# Altium schematic sheet Ada - Sensor - issue 4.0.SchDoc
size A3; Organization: Panik Technology; Address1: Verona House; Address2: Filwood Road; Address3: Bristol BS16 3RY; Address4: Tel: 0117 965 7744; DocumentNumber: 2; Revision: 1.3; SheetNumber: 2; SheetTotal: 3; VersionControl_RevNumber: 1.3; ProjectName: TRI002
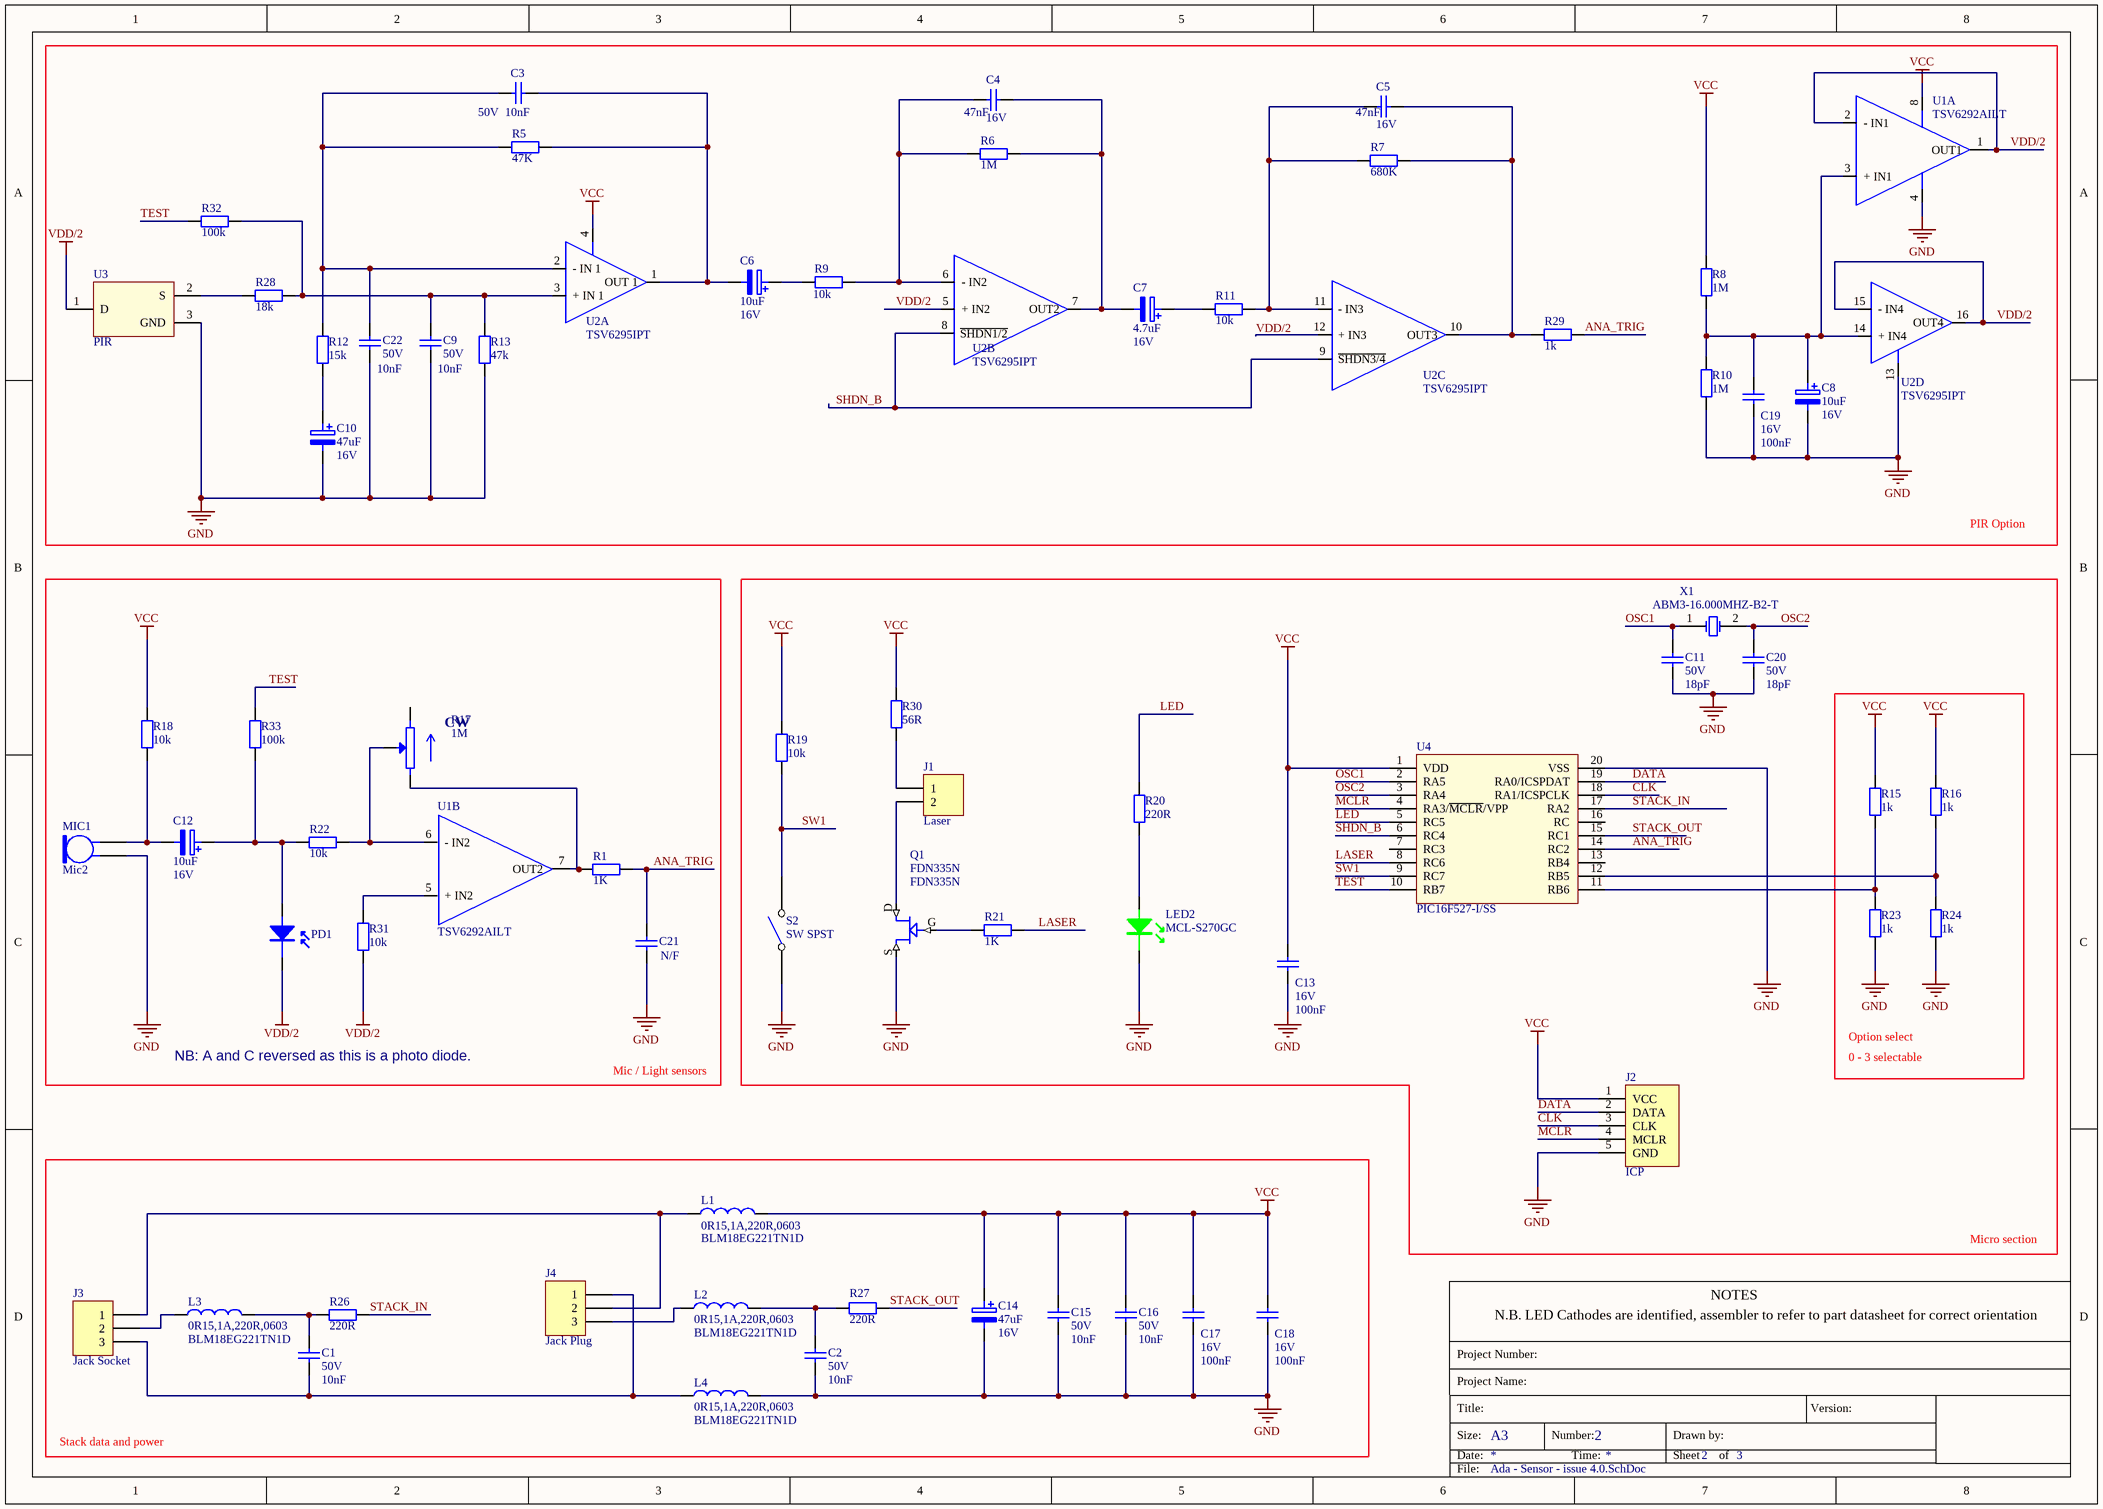
[diagram p0: Ada - Sensor - issue 4.0.SchDoc]

## Parts
C1  Voltage: 50V  [C0603]  (hidden comment: 10nF)
C2  Voltage: 50V  [C0603]  (hidden comment: 10nF)
C3  value 10nF  Voltage: 50V  [C0603]  (hidden comment: Capacitor 0805)
C4  value 47nF  Voltage: 16V  [C0603]  (hidden comment: Capacitor 0603)
C5  value 47nF  Voltage: 16V  [C0603]  (hidden comment: Capacitor 0603)
C6  value 10uF  Voltage: 16V  [CASE_A]  (hidden comment: 10uF, 16V, case A)
C7  value 4.7uF  Voltage: 16V  [CASE_A]  (hidden comment: 4.7uF, 16V, case A)
C8  value 10uF  Voltage: 16V  [CASE_A]  (hidden comment: 10uF, 16V, case A)
C9  value 10nF  Voltage: 50V  [C0603]  (hidden comment: Capacitor 0805)
C10  value 47uF  Voltage: 16V  [CAP6.8/6.8]  (hidden comment: 47uF, 16V, case D8)
C11  Voltage: 50V  [C0603]  (hidden comment: 18pF)
C12  value 10uF  Voltage: 16V  [CASE_A]  (hidden comment: 10uF, 16V, case A)
C13  value 100nF  Voltage: 16V  [C0603]  (hidden comment: 100nF, 16V, 0603)
C14  value 47uF  Voltage: 16V  [CAP6.8/6.8]  (hidden comment: 47uF, 16V, case D8)
C15  Voltage: 50V  [C0603]  (hidden comment: 10nF)
C16  Voltage: 50V  [C0603]  (hidden comment: 10nF)
C17  value 100nF  Voltage: 16V  [C0603]  (hidden comment: 100nF, 16V, 0603)
C18  value 100nF  Voltage: 16V  [C0603]  (hidden comment: 100nF, 16V, 0603)
C19  value 100nF  Voltage: 16V  [C0603]  (hidden comment: 100nF, 16V, 0603)
C20  Voltage: 50V  [C0603]  (hidden comment: 18pF)
C21  value N/F  [C0603]  (hidden comment: Capacitor 0603)
C22  value 10nF  Voltage: 50V  [C0603]  (hidden comment: Capacitor 0805)
J1  Laser  [SIP2]
J2  ICP  [ICP]
J3  Jack Socket  [sip3]
J4  Jack Plug  [3 way sip RA]
L1  0R15,1A,220R,0603  value BLM18EG221TN1D  [L0603]
L2  0R15,1A,220R,0603  value BLM18EG221TN1D  [L0603]
L3  0R15,1A,220R,0603  value BLM18EG221TN1D  [L0603]
L4  0R15,1A,220R,0603  value BLM18EG221TN1D  [L0603]
LED2  value MCL-S270GC  [LED, GREEN, 0805]  (hidden comment: LED GREEN 0805)
MIC1  Mic2  [ECM]
PD1  PHOTODIODE  [DOME LENS]  (value not drawn)
Q1  FDN335N  [SOT-23]
R1  value 1K  [R0603]  (hidden comment: Resistor 0603)
R5  value 47K  [R0603]  (hidden comment: Resistor 0603)
R6  value 1M  [R0603]  (hidden comment: Resistor 0603)
R7  value 680K  [R0603]  (hidden comment: Resistor 0603)
R8  value 1M  [R0603]  (hidden comment: Resistor 0603)
R9  value 10k  [R0603]  (hidden comment: Resistor 0603)
R10  value 1M  [R0603]  (hidden comment: Resistor 0603)
R11  value 10k  [R0603]  (hidden comment: Resistor 0603)
R12  value 15k  [R0603]  (hidden comment: Resistor 0603)
R13  value 47k  [R0603]  (hidden comment: Resistor 0805)
R15  value 1k  [R0603]  (hidden comment: Resistor 0603)
R16  value 1k  [R0603]  (hidden comment: Resistor 0603)
R17  1M  [preset_Iskra square]
R18  value 10k  [R0603]  (hidden comment: Resistor 0603)
R19  value 10k  [R0603]  (hidden comment: Resistor 0603)
R20  value 220R  [R0603]  (hidden comment: Resistor 0603)
R21  value 1K  [R0603]  (hidden comment: Resistor 0603)
R22  value 10k  [R0603]  (hidden comment: Resistor 0603)
R23  value 1k  [R0603]  (hidden comment: Resistor 0603)
R24  value 1k  [R0603]  (hidden comment: Resistor 0603)
R26  value 220R  [R0603]  (hidden comment: Resistor 0603)
R27  value 220R  [R0603]  (hidden comment: Resistor 0603)
R28  value 18k  [R0603]  (hidden comment: Resistor 0603)
R29  value 1k  [R0603]  (hidden comment: Resistor 0603)
R30  value 56R  [R0603]  (hidden comment: Resistor 0603)
R31  value 10k  [R0603]  (hidden comment: Resistor 0603)
R32  value 100k  [R0603]  (hidden comment: Resistor 0603)
R33  value 100k  [R0603]  (hidden comment: Resistor 0603)
S2  SW SPST  [MFP113D]
U1  TSV6292AILT  [SOT23 8 pin]  (parts A,B of 2)
U2  TSV6295IPT  [TSSOP16]  (parts A,B,C,D of 4)
U3  value PIR  [PIR_TO-5]  (hidden comment: LHI_968)
U4  PIC16F527-I/SS  [SSOP20]
X1  value ABM3-16.000MHZ-B2-T  [ABS10]  (hidden comment: XTAL SMD 2pin)

## Blocks framed on the sheet
PIR Option: C3-C10 C19 C22 R5-R13 R28 R29 R32 U1-U3
NB: A and C reversed as this is a photo diode.: C12 C21 MIC1 PD1 R1 R17 R18 R22 R31 R33 U1

## Nets
GND: C2.1 C8.2 C9.1 C10.2 C11.1 C13.1 C14.2 C15.1 C16.1 C17.1 C18.1 C19.1 C20.1 C21.1 C22.1 J2.5(GND) L4.2 LED2.K MIC1.2 Q1.S R10.1 R13.2 R23.1 R24.1 S2.1(COMMON) U1.4(V+) U2.13(V-) U3.3(GND) U4.20(VSS)
VCC: C13.2 C14.1 C15.2 C16.2 C17.2 C18.2 J2.1(VCC) L1.2 R8.2 R15.2 R16.2 R18.2 R19.2 R30.2 U1.8(V+) U2.4(V+) U4.1(VDD)
VDD/2: PD1.K R31.2 U1.1(OUT1) U1.2(-_IN1) U2.5(+_IN2) U2.12(+_IN3) U2.15(-_IN4) U2.16(OUT4) U3.1(D)
ANA_TRIG: C21.2 R1.2 R29.1 U4.14(RC2)
CLK: J2.3(CLK) U4.18(RA1/ICSPCLK)
DATA: J2.2(DATA) U4.19(RA0/ICSPDAT)
LASER: R21.1 U4.8(RC6)
LED: R20.2 U4.5(RC5)
MCLR: J2.4(MCLR) U4.4(RA3/~{MCLR}/VPP)
OSC1: C11.2 U4.2(RA5) X1.1(OSC1)
OSC2: C20.2 U4.3(RA4) X1.2(OSC2)
SHDN_B: U2.8(~{SHDN1/2}) U2.9(~{SHDN3/4}) U4.6(RC4)
STACK_IN: R26.1 U4.17(RA2)
STACK_OUT: R27.1 U4.15(RC1)
SW1: R19.1 S2.2(NO) U4.9(RC7)
TEST: R32.2 R33.1 U4.10(RB7)
NetC1_1: C1.1 J3.3 J4.1 L4.1
NetC1_2: C1.2 L3.2 R26.2
NetC2_2: C2.2 L2.2 R27.2
NetC3_1: C3.1 C6.2 R5.1 U2.1(OUT_1)
NetC3_2: C3.2 C22.2 R5.2 R12.2 U2.2(-_IN_1)
NetC4_1: C4.1 C7.2 R6.2 U2.7(OUT2)
NetC4_2: C4.2 R6.1 R9.1 U2.6(-_IN2)
NetC5_1: C5.1 R7.1 R29.2 U2.10(OUT3)
NetC5_2: C5.2 R7.2 R11.1 U2.11(-_IN3)
NetC6_1: C6.1 R9.2
NetC7_1: C7.1 R11.2
NetC8_1: C8.1 C19.2 R8.1 R10.2 U1.3(+_IN1) U2.14(+_IN4)
NetC9_2: C9.2 R13.1 R28.1 R32.1 U2.3(+_IN_1)
NetC10_1: C10.1 R12.1
NetC12_1: C12.1 PD1.A R22.2 R33.2
NetC12_2: C12.2 MIC1.1 R18.1
NetJ1_1: J1.1 R30.1
NetJ1_2: J1.2 Q1.D
NetJ3_1: J3.1 J4.2 L1.1
NetJ3_2: J3.2 L3.1
NetJ4_3: J4.3 L2.1
NetLED2_A: LED2.A R20.1
NetQ1_G: Q1.G R21.2
NetR1_1: R1.1 R17.2 U1.7(OUT2)
NetR15_1: R15.1 R23.2 U4.11(RB6)
NetR16_1: R16.1 R24.2 U4.12(RB5)
NetR17_W: R17.W R22.1 U1.6(-_IN2)
NetR28_2: R28.2 U3.2(S)
NetR31_1: R31.1 U1.5(+_IN2)

Not connected (* = marked no-connect by the designer): R17 1; U4 7(RC3) 13(RB4) 16(RC)

## Notes on the sheet
- Option select
- Mic / Light sensors
- 0 - 3 selectable
- Micro section
- Stack data and power
- N.B. LED Cathodes are identified, assembler to refer to part datasheet for correct orientation
- NOTES
- Project Name:
- Project Number:
- Title:
- Size:
- Date:
- A3
- Number:
- Time:
- Sheet
- Drawn by:
- of
- Version:
- File:
- (in symbol POT2) CW

## Library data of the parts
C1 C2 C15 C16 = 10nF, 50V, 0603: Ceramic; Manufacturer: MULTICOMP; Manuf Part #: MCCA000238; Part No.: 71-1964; FEC#: 1759104; Supplier: Rapid; Value: 10nF
C3 C9 C22 = Capacitor 0805: Ceramic; Manufacturer: MULTICOMP; Manuf Part #: MCCA000238; Part No.: 71-1964; FEC#: 1759104; Supplier: Rapid
C4 C5 = Capacitor 0603: Ceramic; Manufacturer: YAGEO; Manuf Part #: CC0603KRX7R7BB473; FEC#: 432027; Part No.: 432027; Supplier: FEC
C6 C8 C12 = 47uF, 25V, case D8: ELECTROLYTIC; Manufacturer: VISHAY SPRAGUE; Manuf Part #: 293D106X9016A2TE3; FEC#: 1754182; Part No.: 1754182; Supplier: FEC
C7 = 47uF, 25V, case D8: TANT; Manufacturer: VISHAY SPRAGUE; Manuf Part #: 293D475X9016A2TE3; FEC#: 1754181; Part No.: 1754181; Supplier: FEC
C10 C14 = 47uF, 25V, case D8: ELECTROLYTIC; Manufacturer: NICHICON; Manuf Part #: UUT1C470MCL1GS; FEC#: 8823200; Part No.: 8823200; Supplier: FEC
C11 C20 = 18pF, 50V, 0603: Ceramic; Manufacturer: KEMET; Manuf Part #: C0603C180J5GAC; FEC#: 1414620; Part No.: 1414620; Supplier: FEC; Value: 18pF
C13 C17-C19 = 100nF, 16V, 0603: Ceramic; Manufacturer: TruCap; Manuf Part #: B0603R104; Part No.: 71-1974; FEC#: 9406140; Supplier: Rapid
C21 = Capacitor 0603: Ceramic
J1 = Header 2: Header, 2-Pin; Value: SIP 2
J2 = ICP: PIC IN CIRCUIT PROGRAMMING HEADER; Manufacturer: TruConnect; Manuf Part #: 22-0510; Part No.: 22-0510; Supplier: Rapid; Value: ICP
J3 = Header 3: Header, 3-Pin; Value: N/F
J4 = Header 3: Header, 3-Pin
L1-L4 = 0R15,1A,220R,0603: FERRITE BEAD; Manufacturer: MURATA; FEC#: 1515717; RS#: 724-1328; Current: 1A; Manuf Part #: BLM18EG221TN1D; Part No.: 1515717; Supplier: FEC
LED2 = LED GREEN 0805: MULTICOMP; FEC#: 1581242; Manufacturer: MULTICOMP; Manuf Part #: MCL-S270GC; Part No.: 1581242; Supplier: FEC
MIC1 = Mic2: PROJECTS UNLIMITED - AOM-4542P-R - MICROPHONE, OMNI PCB, 9.7MM; FEC#: 1193029; Manufacturer: PROJECTS UNLIMITED; Manuf Part #: AOM-4542P-R; Value: AOM-4542P-R; Part No.: 1193029; Supplier: FEC
PD1 = PHOTODIODE: DIODE, PIN, SMD, DOME LENS; Manufacturer: VISHAY; Manuf Part #: VEMD2520X01; FEC#: 1870779; Value: VEMD2520X01; Part No.: 1870779
Q1 = FDN335N: Manufacturer: FAIRCHILD SEMICONDUCTOR; FEC#: 9845348RL; Manuf Part #: FDN335N; Part No.: 9845348RL; Supplier: FEC; Value: FDN335N
R17 = POT2: 1m Pnz10za Preset Potentiometer; Manufacturer: Iskra; Manuf Part #: PNZ10ZA 1M; Part No.: 67-0478; Value: PNZ10ZA 1M; Supplier: Rapid
S2 = SW SPST: Manufacturer: KNITTER-SWITCH; RS#: 702-3634; Value: MFP113D; Manuf Part #: MFP113D; Part No.: 702-3634; Supplier: RS
U1 = TSV6292AILT: low power Op Amp; Manufacturer: STMICROELECTRONICS; FEC#: 2067873; Manuf Part #: TSV6292AILT; Part No.: 2067873; Supplier: FEC; Value: TSV6292AILT
U2 = TSV6295IPT: low power Op Amp; Manufacturer: STMICROELECTRONICS; FEC#: 1842580; Manuf Part #: TSV6295IPT; Part No.: 1842580; Supplier: FEC; Value: TSV6295IPT
U3 = LHI_968: PIR detector; Manufacturer: EXCELITAS TECH; FEC#: 2293504; Voltage: 2V - 12V; Manuf Part #: LHI_968; Part No.: 2293504; Supplier: FEC
U4 = PIC16F527: 8bit uProcessor; Manufacturer: MICROCHIP; FEC#: 2301100; Voltage: 5V; Manuf Part #: PIC16F527-I/SS; Part No.: 2301100; Supplier: FEC; Value: PIC16F527-I/SS
X1 = XTAL SMD 2pin: CRYSTAL, 16MHZ, 18PF CL, 5X3.2MM, SMT; Manufacturer: ABRACON; FEC#: 1611806; Manuf Part #: ABM3-16.000MHZ-B2-T; Part No.: 1611806; Supplier: FEC